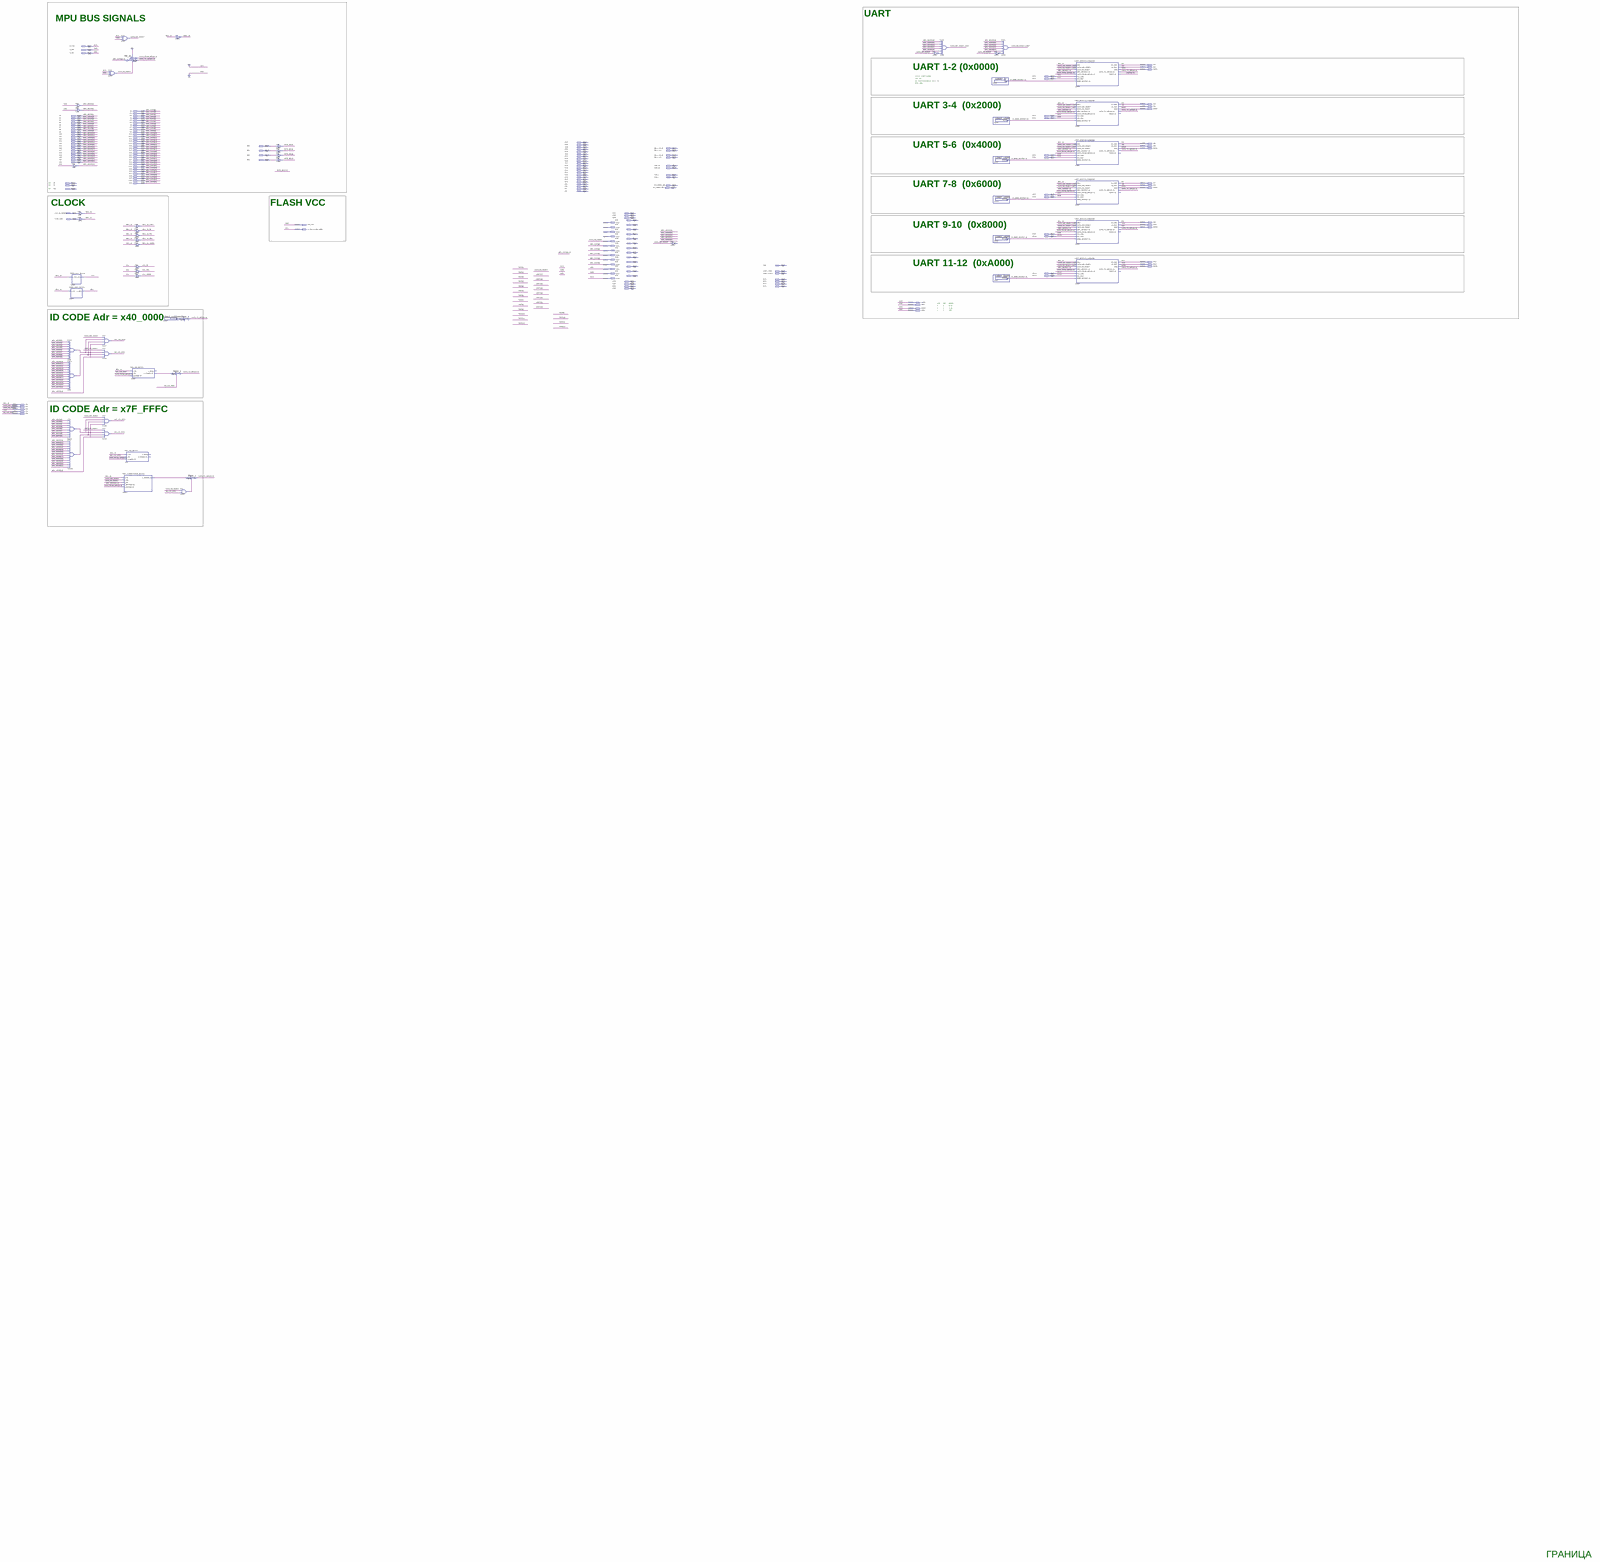
[diagram p0: schematic sheet, whole]
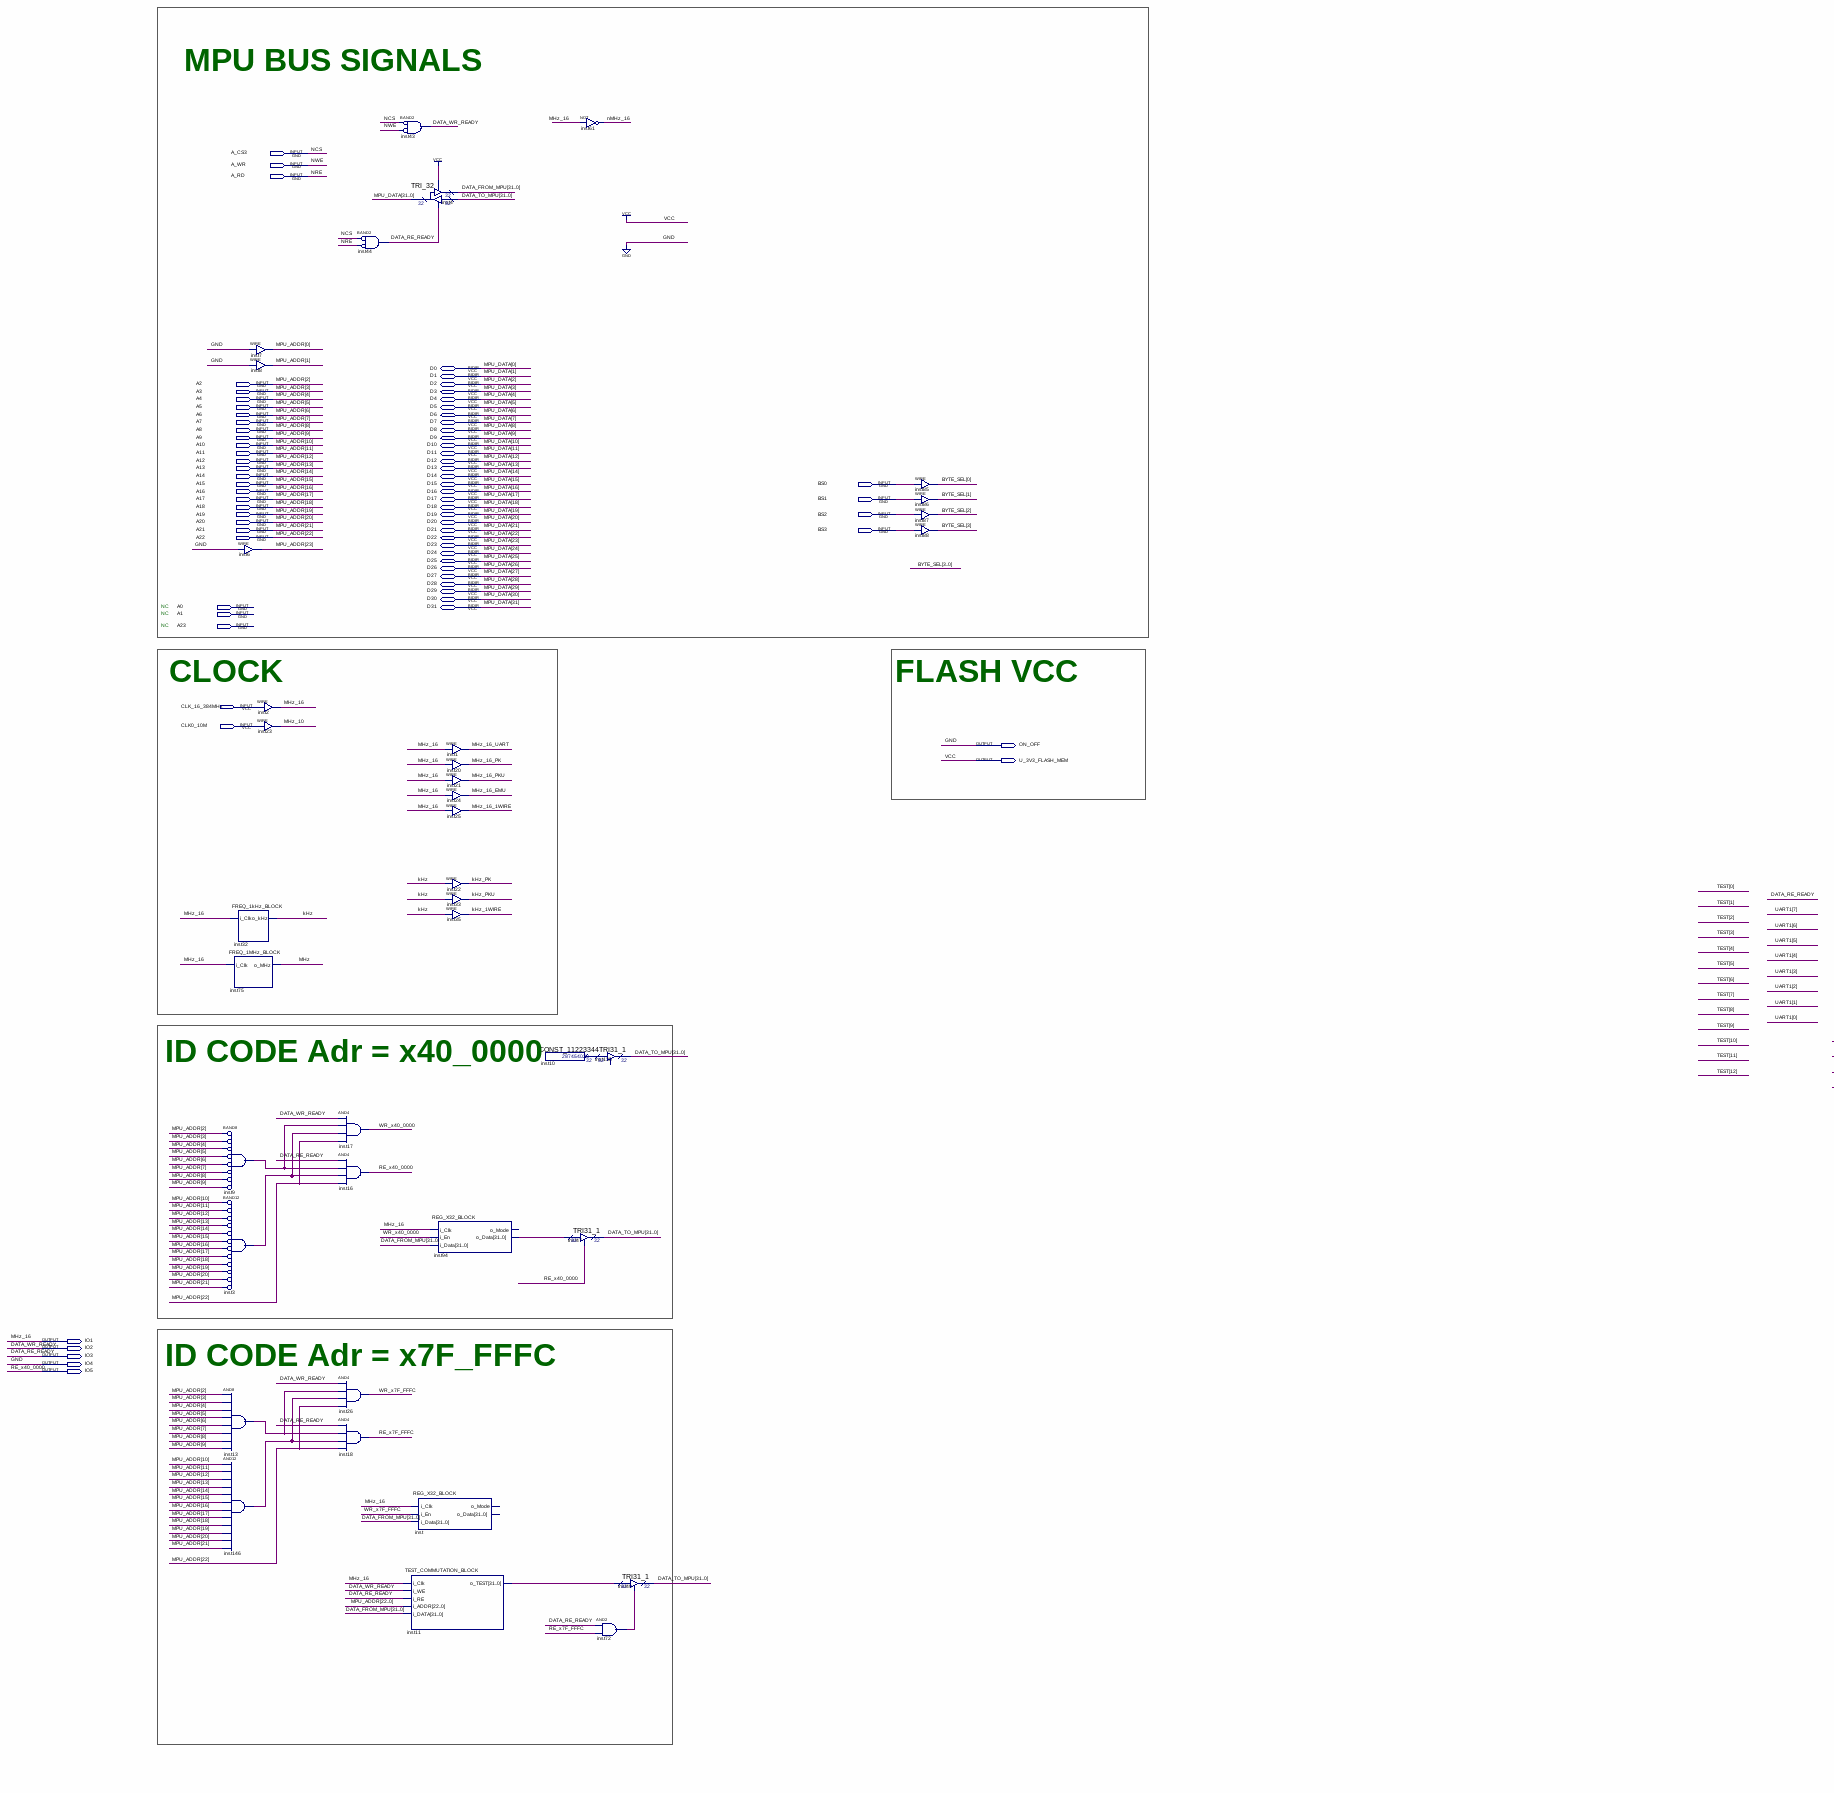
[diagram p1: schematic sheet, upper left part]
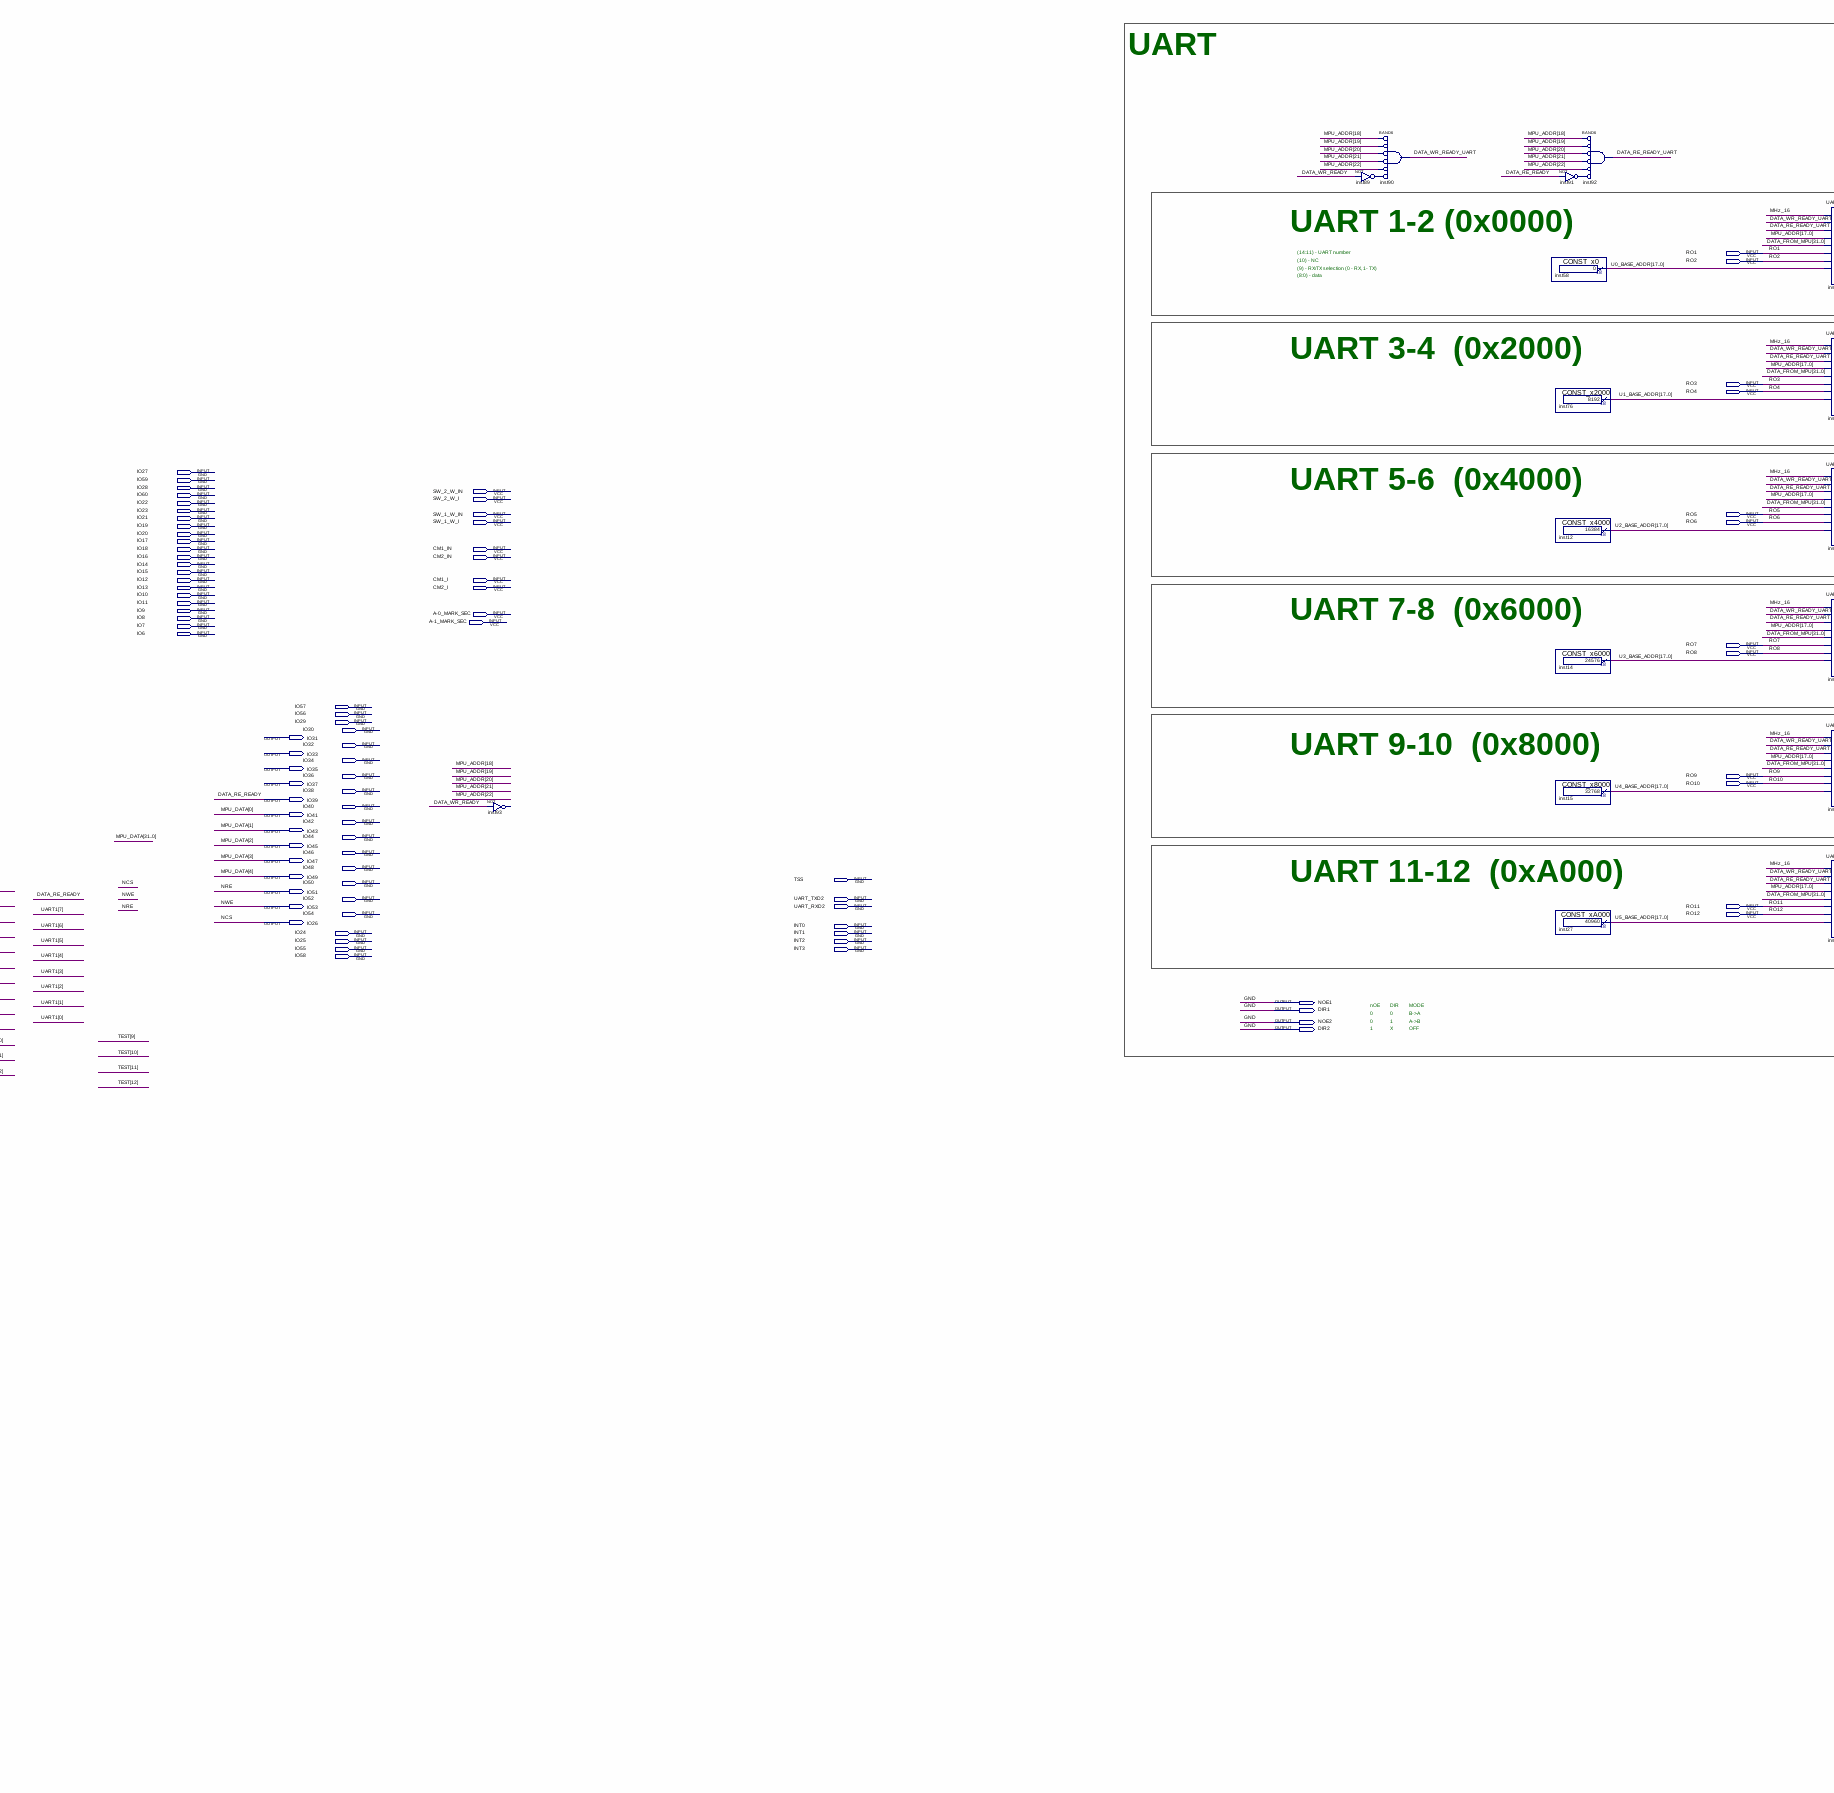
[diagram p2: schematic sheet, upper centre part]
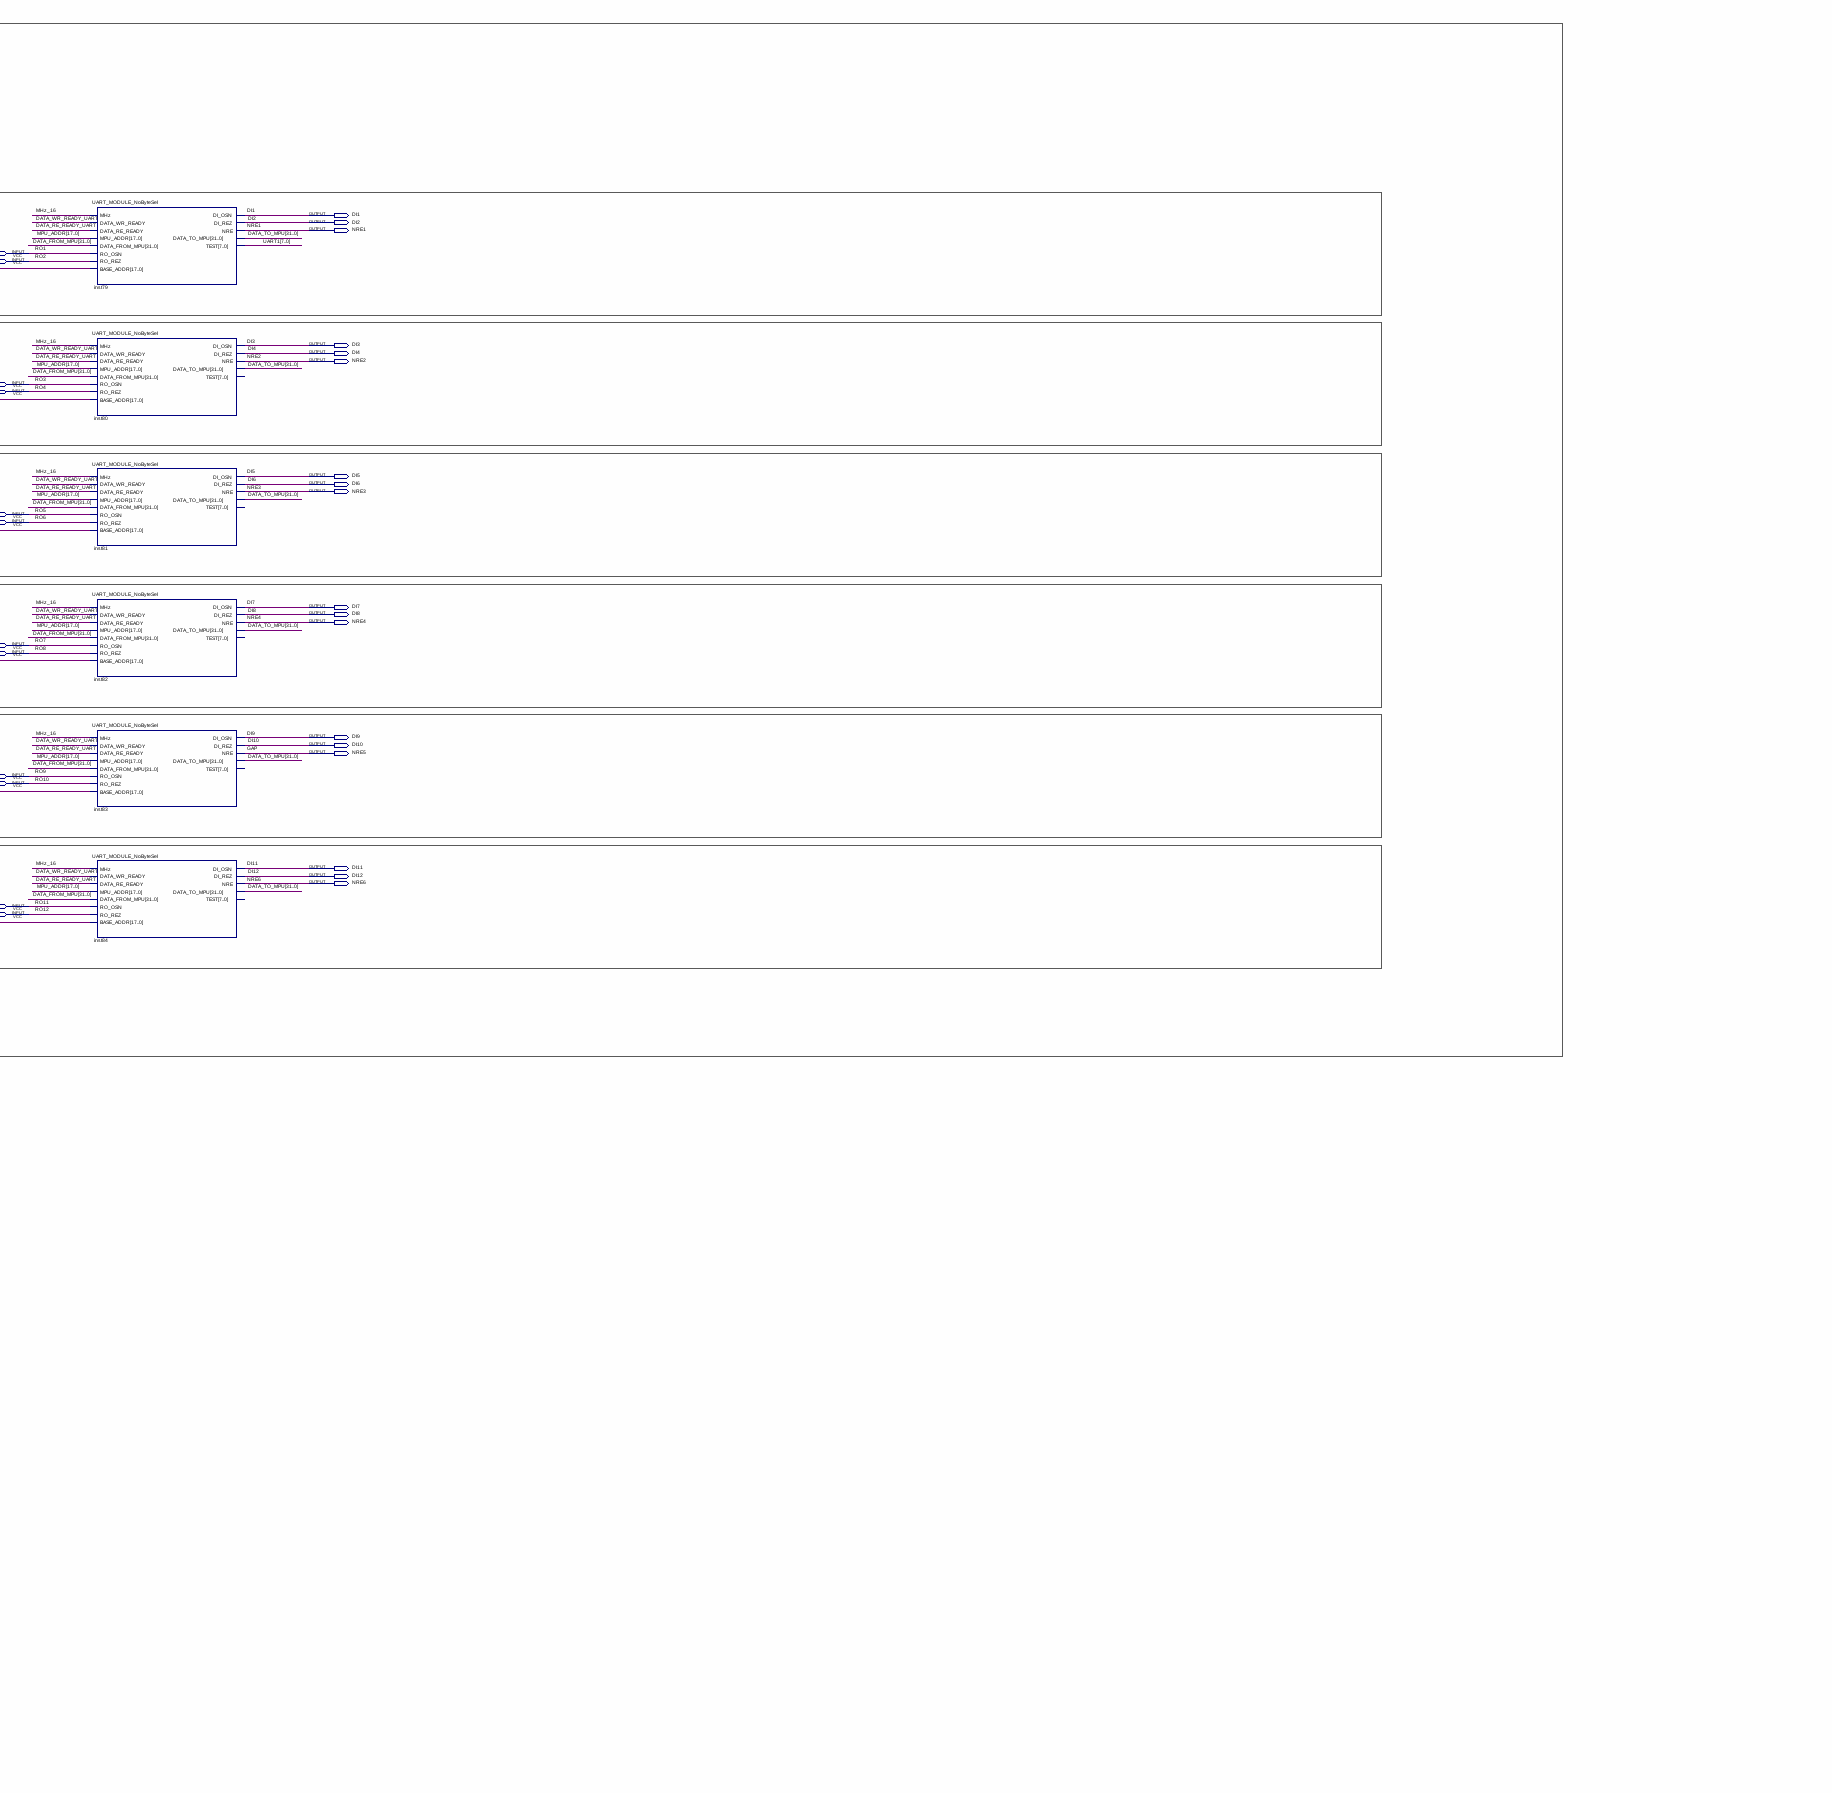
[diagram p3: schematic sheet, upper right part]
// Quartus schematic TOP.bdf as structural Verilog: 56 symbols, 178 pins
module TOP (
  input  A_CS3,
  input  A_WR,
  input  A_RD,
  input  RO1,
  input  RO2,
  input  A2,
  input  RO3,
  input  A3,
  input  RO4,
  input  A4,
  input  A5,
  input  A6,
  input  A7,
  input  A8,
  input  A9,
  input  A10,
  input  A11,
  input  A12,
  input  A13,
  input  IO27,
  input  A14,
  input  IO59,
  input  A15,
  input  BS0,
  input  IO28,
  input  A16,
  input  SW_2_W_IN,
  input  IO60,
  input  A17,
  input  BS1,
  input  SW_2_W_I,
  input  IO22,
  input  A18,
  input  IO23,
  input  A19,
  input  BS2,
  input  SW_1_W_IN,
  input  RO5,
  input  IO21,
  input  A20,
  input  SW_1_W_I,
  input  RO6,
  input  IO19,
  input  A21,
  input  BS3,
  input  IO20,
  input  A22,
  input  IO17,
  input  IO18,
  input  CM1_IN,
  input  IO16,
  input  CM2_IN,
  input  IO14,
  input  IO15,
  input  IO12,
  input  CM1_I,
  input  IO13,
  input  CM2_I,
  input  IO10,
  input  IO11,
  input  A0,
  input  IO9,
  input  A1,
  input  \A-0_MARK_SEC ,
  input  IO8,
  input  \A-1_MARK_SEC ,
  input  A23,
  input  IO7,
  input  IO6,
  input  RO7,
  input  RO8,
  input  CLK_16_384MHz,
  input  IO57,
  input  IO56,
  input  IO29,
  input  CLK0_10M,
  input  IO30,
  input  IO32,
  input  IO34,
  input  IO36,
  input  RO9,
  input  RO10,
  input  IO38,
  input  IO40,
  input  IO42,
  input  IO44,
  input  IO46,
  input  IO48,
  input  TSS,
  input  IO50,
  input  IO52,
  input  UART_TXD2,
  input  UART_RXD2,
  input  RO11,
  input  IO54,
  input  RO12,
  input  INT0,
  input  IO24,
  input  INT1,
  input  IO25,
  input  INT2,
  input  IO55,
  input  INT3,
  input  IO58,
  inout  D0,
  inout  D1,
  inout  D2,
  inout  D3,
  inout  D4,
  inout  D5,
  inout  D6,
  inout  D7,
  inout  D8,
  inout  D9,
  inout  D10,
  inout  D11,
  inout  D12,
  inout  D13,
  inout  D14,
  inout  D15,
  inout  D16,
  inout  D17,
  inout  D18,
  inout  D19,
  inout  D20,
  inout  D21,
  inout  D22,
  inout  D23,
  inout  D24,
  inout  D25,
  inout  D26,
  inout  D27,
  inout  D28,
  inout  D29,
  inout  D30,
  inout  D31,
  output DI1,
  output DI2,
  output NRE1,
  output DI3,
  output DI4,
  output NRE2,
  output DI5,
  output DI6,
  output NRE3,
  output DI7,
  output DI8,
  output NRE4,
  output IO31,
  output DI9,
  output ON_OFF,
  output DI10,
  output IO33,
  output NRE5,
  output U_3V3_FLASH_MEM,
  output IO35,
  output IO37,
  output IO39,
  output IO41,
  output IO43,
  output IO45,
  output IO47,
  output DI11,
  output IO49,
  output DI12,
  output NRE6,
  output IO51,
  output IO53,
  output IO26,
  output NOE1,
  output DIR1,
  output NOE2,
  output DIR2,
  output IO1,
  output IO2,
  output IO3,
  output IO4,
  output IO5
);

  wire DATA_RE_READY_UART, DATA_WR_READY_UART, inst3_out, inst9_out, inst13_out, inst72_out, inst89_out,
       inst91_out, inst146_out, kHz, kHz_1WIRE, kHz_PK, kHz_PKU, MHz, MHz_10, MHz_16_1WIRE, MHz_16_EMU,
       MHz_16_PK, MHz_16_PKU, MHz_16_UART, nMHz_16, RE_x7F_FFFC, WR_x7F_FFFC, WR_x40_0000;
  wire [3:0] BYTE_SEL;
  wire [7:0] UART1;
  wire [17:0] U0_BASE_ADDR, U1_BASE_ADDR, U2_BASE_ADDR, U3_BASE_ADDR, U4_BASE_ADDR, U5_BASE_ADDR;
  wire [23:0] MPU_ADDR;
  wire [31:0] DATA_FROM_MPU, DATA_TO_MPU, inst10_result, inst11_o_test, inst94_o_data;

  FREQ_1kHz_BLOCK inst32 (.i_Clk(IO1), .o_kHz(kHz));
  FREQ_1MHz_BLOCK inst75 (.i_Clk(IO1), .o_MHz(MHz));
  and inst9 (inst9_out, ~A2, ~A3, ~A4, ~A5, ~A6, ~A7, ~A8, ~A9);  // BAND8
  and inst3 (inst3_out, ~A10, ~A11, ~A12, ~A13, ~A14, ~A15, ~A16, ~A17, ~A18, ~A19, ~A20, ~A21);  // BAND12
  and inst13 (inst13_out, A2, A3, A4, A5, A6, A7, A8, A9);
  and inst146 (inst146_out, A10, A11, A12, A13, A14, A15, A16, A17, A18, A19, A20, A21);
  assign MPU_ADDR[0] = 1'b0;  // WIRE inst7
  assign MPU_ADDR[1] = 1'b0;  // WIRE inst8
  assign MPU_ADDR[23] = 1'b0;  // WIRE inst6
  assign IO1 = CLK_16_384MHz;  // WIRE inst2
  assign MHz_10 = CLK0_10M;  // WIRE inst23
  and inst17 (WR_x40_0000, IO2, inst9_out, inst3_out, A22);
  and inst16 (IO5, IO3, inst9_out, inst3_out, A22);
  and inst26 (WR_x7F_FFFC, IO2, inst13_out, inst146_out, A22);
  and inst18 (RE_x7F_FFFC, IO3, inst13_out, inst146_out, A22);
  and inst44 (IO3, ~A_CS3, ~A_RD);  // BAND2
  and inst43 (IO2, ~A_CS3, ~A_WR);  // BAND2
  TRI_32 inst4 (
    .enabledt(IO3), .data(DATA_TO_MPU), .enabletr(1'b1), .result(DATA_FROM_MPU),
    .tridata({D31, D30, D29, D28, D27, D26, D25, D24, D23, D22, D21, D20, D19, D18, D17, D16, D15, D14, D13, D12, D11, D10, D9, D8, D7, D6, D5, D4, D3, D2, D1, D0}));
  REG_X32_BLOCK inst (.i_Clk(IO1), .i_En(WR_x7F_FFFC), .i_Data(DATA_FROM_MPU));  // open: o_Mode, o_Data
  TEST_COMMUTATION_BLOCK inst11 (
    .i_Clk(IO1), .i_WE(IO2), .i_RE(IO3),
    .i_ADDR({A22, A21, A20, A19, A18, A17, A16, A15, A14, A13, A12, A11, A10, A9, A8, A7, A6, A5, A4, A3, A2, MPU_ADDR[1:0]}),
    .i_DATA(DATA_FROM_MPU), .o_TEST(inst11_o_test));
  assign MHz_16_UART = IO1;  // WIRE inst1
  assign MHz_16_PK = IO1;  // WIRE inst20
  assign MHz_16_PKU = IO1;  // WIRE inst21
  assign MHz_16_EMU = IO1;  // WIRE inst24
  assign MHz_16_1WIRE = IO1;  // WIRE inst25
  assign kHz_PK = kHz;  // WIRE inst22
  assign kHz_PKU = kHz;  // WIRE inst33
  assign kHz_1WIRE = kHz;  // WIRE inst35
  REG_X32_BLOCK inst94 (
    .i_Clk(IO1), .i_En(WR_x40_0000), .i_Data(DATA_FROM_MPU), .o_Data(inst94_o_data));  // open: o_Mode
  CONST_11223344 inst10 (.result(inst10_result));
  TRI31_1 inst47 (.enabledt(IO5), .data(inst94_o_data), .tridata(DATA_TO_MPU));
  not inst61 (nMHz_16, IO1);
  TRI31_1 inst130 (.data(inst10_result), .tridata(DATA_TO_MPU));  // open: enabledt
  and inst72 (inst72_out, IO3, RE_x7F_FFFC);
  TRI31_1 inst49 (.enabledt(inst72_out), .data(inst11_o_test), .tridata(DATA_TO_MPU));
  assign BYTE_SEL[0] = BS0;  // WIRE inst85
  assign BYTE_SEL[1] = BS1;  // WIRE inst86
  assign BYTE_SEL[2] = BS2;  // WIRE inst87
  assign BYTE_SEL[3] = BS3;  // WIRE inst88
  // NOT inst93 has open pins: IN=IO2, OUT=open
  not inst89 (inst89_out, IO2);
  and inst90 (DATA_WR_READY_UART, ~A18, ~A19, ~A20, ~A21, ~A22, ~inst89_out);  // BAND6
  not inst91 (inst91_out, IO3);
  CONST_x0 inst58 (.result(U0_BASE_ADDR));
  CONST_x2000 inst76 (.result(U1_BASE_ADDR));
  CONST_x4000 inst12 (.result(U2_BASE_ADDR));
  CONST_x6000 inst14 (.result(U3_BASE_ADDR));
  CONST_x8000 inst15 (.result(U4_BASE_ADDR));
  CONST_xA000 inst27 (.result(U5_BASE_ADDR));
  and inst92 (DATA_RE_READY_UART, ~A18, ~A19, ~A20, ~A21, ~A22, ~inst91_out);  // BAND6
  UART_MODULE_NoByteSel inst79 (
    .MHz(IO1), .DATA_WR_READY(DATA_WR_READY_UART), .DATA_RE_READY(DATA_RE_READY_UART),
    .MPU_ADDR({A17, A16, A15, A14, A13, A12, A11, A10, A9, A8, A7, A6, A5, A4, A3, A2, MPU_ADDR[1:0]}),
    .DATA_FROM_MPU(DATA_FROM_MPU), .RO_OSN(RO1), .RO_REZ(RO2), .BASE_ADDR(U0_BASE_ADDR), .DI_OSN(DI1),
    .DI_REZ(DI2), .NRE(NRE1), .DATA_TO_MPU(DATA_TO_MPU), .TEST(UART1));
  UART_MODULE_NoByteSel inst80 (
    .MHz(IO1), .DATA_WR_READY(DATA_WR_READY_UART), .DATA_RE_READY(DATA_RE_READY_UART),
    .MPU_ADDR({A17, A16, A15, A14, A13, A12, A11, A10, A9, A8, A7, A6, A5, A4, A3, A2, MPU_ADDR[1:0]}),
    .DATA_FROM_MPU(DATA_FROM_MPU), .RO_OSN(RO3), .RO_REZ(RO4), .BASE_ADDR(U1_BASE_ADDR), .DI_OSN(DI3),
    .DI_REZ(DI4), .NRE(NRE2), .DATA_TO_MPU(DATA_TO_MPU));  // open: TEST
  UART_MODULE_NoByteSel inst81 (
    .MHz(IO1), .DATA_WR_READY(DATA_WR_READY_UART), .DATA_RE_READY(DATA_RE_READY_UART),
    .MPU_ADDR({A17, A16, A15, A14, A13, A12, A11, A10, A9, A8, A7, A6, A5, A4, A3, A2, MPU_ADDR[1:0]}),
    .DATA_FROM_MPU(DATA_FROM_MPU), .RO_OSN(RO5), .RO_REZ(RO6), .BASE_ADDR(U2_BASE_ADDR), .DI_OSN(DI5),
    .DI_REZ(DI6), .NRE(NRE3), .DATA_TO_MPU(DATA_TO_MPU));  // open: TEST
  UART_MODULE_NoByteSel inst82 (
    .MHz(IO1), .DATA_WR_READY(DATA_WR_READY_UART), .DATA_RE_READY(DATA_RE_READY_UART),
    .MPU_ADDR({A17, A16, A15, A14, A13, A12, A11, A10, A9, A8, A7, A6, A5, A4, A3, A2, MPU_ADDR[1:0]}),
    .DATA_FROM_MPU(DATA_FROM_MPU), .RO_OSN(RO7), .RO_REZ(RO8), .BASE_ADDR(U3_BASE_ADDR), .DI_OSN(DI7),
    .DI_REZ(DI8), .NRE(NRE4), .DATA_TO_MPU(DATA_TO_MPU));  // open: TEST
  UART_MODULE_NoByteSel inst83 (
    .MHz(IO1), .DATA_WR_READY(DATA_WR_READY_UART), .DATA_RE_READY(DATA_RE_READY_UART),
    .MPU_ADDR({A17, A16, A15, A14, A13, A12, A11, A10, A9, A8, A7, A6, A5, A4, A3, A2, MPU_ADDR[1:0]}),
    .DATA_FROM_MPU(DATA_FROM_MPU), .RO_OSN(RO9), .RO_REZ(RO10), .BASE_ADDR(U4_BASE_ADDR), .DI_OSN(DI9),
    .DI_REZ(DI10), .NRE(NRE5), .DATA_TO_MPU(DATA_TO_MPU));  // open: TEST
  UART_MODULE_NoByteSel inst84 (
    .MHz(IO1), .DATA_WR_READY(DATA_WR_READY_UART), .DATA_RE_READY(DATA_RE_READY_UART),
    .MPU_ADDR({A17, A16, A15, A14, A13, A12, A11, A10, A9, A8, A7, A6, A5, A4, A3, A2, MPU_ADDR[1:0]}),
    .DATA_FROM_MPU(DATA_FROM_MPU), .RO_OSN(RO11), .RO_REZ(RO12), .BASE_ADDR(U5_BASE_ADDR), .DI_OSN(DI11),
    .DI_REZ(DI12), .NRE(NRE6), .DATA_TO_MPU(DATA_TO_MPU));  // open: TEST

  assign DIR1 = 1'b0;
  assign DIR2 = 1'b0;
  assign IO4 = 1'b0;
  assign IO26 = A_CS3;
  assign IO39 = IO3;
  assign IO41 = D0;
  assign IO43 = D1;
  assign IO45 = D2;
  assign IO47 = D3;
  assign IO49 = D4;
  assign IO51 = A_RD;
  assign IO53 = A_WR;
  assign NOE1 = 1'b0;
  assign NOE2 = 1'b0;
  assign ON_OFF = 1'b0;
  assign U_3V3_FLASH_MEM = 1'b1;

  // Other names for the same wires on the sheet: DATA_RE_READY = IO3; DATA_WR_READY = IO2; GAP = NRE5; MHz_16 = IO1;
  //   MPU_ADDR[22:2] = {A22, A21, A20, A19, A18, A17, A16, A15, A14, A13, A12, A11, A10, A9, A8, A7, A6, A5, A4, A3, A2};
  //   MPU_DATA[31:0] = {D31, D30, D29, D28, D27, D26, D25, D24, D23, D22, D21, D20, D19, D18, D17, D16, D15, D14, D13, D12, D11, D10, D9, D8, D7, D6, D5, D4, D3, D2, D1, D0};
  //   NCS = A_CS3; NRE = A_RD; NWE = A_WR; RE_x40_0000 = IO5

  // Notes on the sheet:
  //   UART
  //   MPU BUS SIGNALS
  //   UART 1-2 (0x0000)
  //   (14:11) - UART number
  //   (10) - NC
  //   (9) - RX/TX selection (0 - RX, 1- TX)
  //   (8:0) - data
  //   UART 3-4  (0x2000)
  //   UART 5-6  (0x4000)
  //   UART 7-8  (0x6000)
  //   NC
  //   NC
  //   NC
  //   CLOCK
  //   FLASH VCC
  //   UART 9-10  (0x8000)
  //   UART 11-12  (0xA000)
  //   nOE
  //   DIR
  //   MODE
  //   0
  //   0
  //   B->A
  //   0
  //   1
  //   A->B
  //   1
  //   X
  //   OFF
  //   ID CODE Adr = x40_0000
  //   ID CODE Adr = x7F_FFFC
  //   ГРАНИЦА
endmodule
